# Altium schematic sheet 22-1G_SFP.SchDoc
size B; SheetNumber: 22; SheetTotal: 22
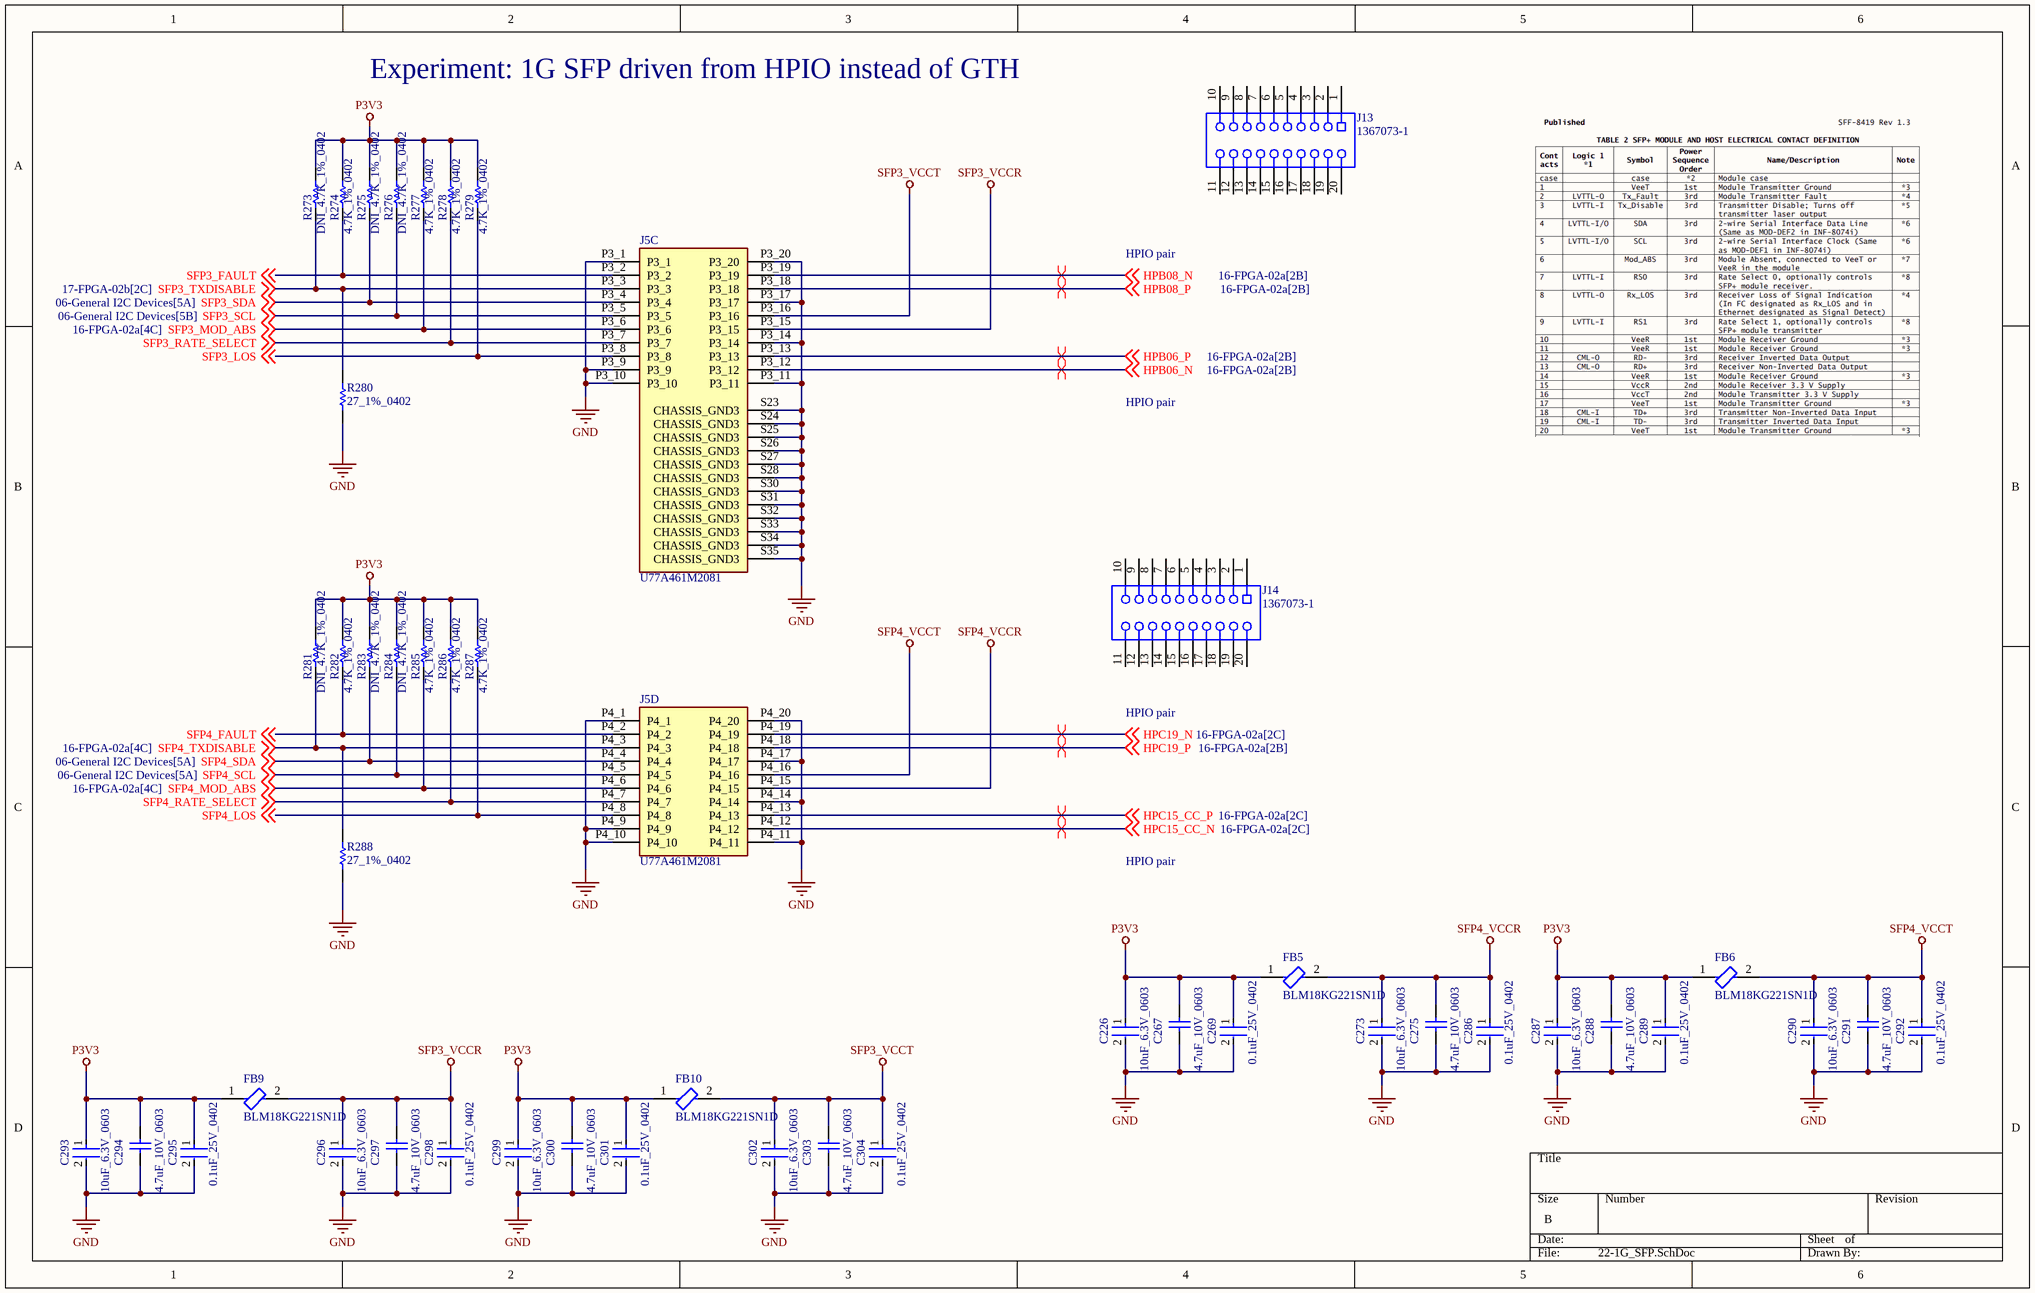
[diagram p0: 22-1G_SFP.SchDoc]

## Parts
C226  10uF_6.3V_0603  [FP-C0603C106M9PACTU-MFG]
C267  4.7uF_10V_0603  [CAPC1608X87X35NL15T15]
C269  0.1uF_25V_0402  [FP-0402-L_1_0_1-W_0_5_0_1-IPC_C]
C273  10uF_6.3V_0603  [FP-C0603C106M9PACTU-MFG]
C275  4.7uF_10V_0603  [CAPC1608X87X35NL15T15]
C286  0.1uF_25V_0402  [FP-0402-L_1_0_1-W_0_5_0_1-IPC_C]
C287  10uF_6.3V_0603  [FP-C0603C106M9PACTU-MFG]
C288  4.7uF_10V_0603  [CAPC1608X87X35NL15T15]
C289  0.1uF_25V_0402  [FP-0402-L_1_0_1-W_0_5_0_1-IPC_C]
C290  10uF_6.3V_0603  [FP-C0603C106M9PACTU-MFG]
C291  4.7uF_10V_0603  [CAPC1608X87X35NL15T15]
C292  0.1uF_25V_0402  [FP-0402-L_1_0_1-W_0_5_0_1-IPC_C]
C293  10uF_6.3V_0603  [FP-C0603C106M9PACTU-MFG]
C294  4.7uF_10V_0603  [CAPC1608X87X35NL15T15]
C295  0.1uF_25V_0402  [FP-0402-L_1_0_1-W_0_5_0_1-IPC_C]
C296  10uF_6.3V_0603  [FP-C0603C106M9PACTU-MFG]
C297  4.7uF_10V_0603  [CAPC1608X87X35NL15T15]
C298  0.1uF_25V_0402  [FP-0402-L_1_0_1-W_0_5_0_1-IPC_C]
C299  10uF_6.3V_0603  [FP-C0603C106M9PACTU-MFG]
C300  4.7uF_10V_0603  [CAPC1608X87X35NL15T15]
C301  0.1uF_25V_0402  [FP-0402-L_1_0_1-W_0_5_0_1-IPC_C]
C302  10uF_6.3V_0603  [FP-C0603C106M9PACTU-MFG]
C303  4.7uF_10V_0603  [CAPC1608X87X35NL15T15]
C304  0.1uF_25V_0402  [FP-0402-L_1_0_1-W_0_5_0_1-IPC_C]
FB5  BLM18KG221SN1D  [FP-BLM18-0_15-t0_8-IPC_B]
FB6  BLM18KG221SN1D  [FP-BLM18-0_15-t0_8-IPC_B]
FB9  BLM18KG221SN1D  [FP-BLM18-0_15-t0_8-IPC_B]
FB10  BLM18KG221SN1D  [FP-BLM18-0_15-t0_8-IPC_B]
J5  U77A461M2081  [AMPHENOL_U77A461M2081]  (parts C,D of 4)
J13  1367073-1  [TECO-1367073-1_V]
J14  1367073-1  [TECO-1367073-1_V]
R273  DNI_4.7K_1%_0402  [RESC1005X40X25NL10T10]  (no BOM)
R274  4.7K_1%_0402  [RESC1005X40X25NL10T10]
R275  DNI_4.7K_1%_0402  [RESC1005X40X25NL10T10]  (no BOM)
R276  DNI_4.7K_1%_0402  [RESC1005X40X25NL10T10]  (no BOM)
R277  4.7K_1%_0402  [RESC1005X40X25NL10T10]
R278  4.7K_1%_0402  [RESC1005X40X25NL10T10]
R279  4.7K_1%_0402  [RESC1005X40X25NL10T10]
R280  27_1%_0402  [RESC1005X40X25NL05T05]
R281  DNI_4.7K_1%_0402  [RESC1005X40X25NL10T10]  (no BOM)
R282  4.7K_1%_0402  [RESC1005X40X25NL10T10]
R283  DNI_4.7K_1%_0402  [RESC1005X40X25NL10T10]  (no BOM)
R284  DNI_4.7K_1%_0402  [RESC1005X40X25NL10T10]  (no BOM)
R285  4.7K_1%_0402  [RESC1005X40X25NL10T10]
R286  4.7K_1%_0402  [RESC1005X40X25NL10T10]
R287  4.7K_1%_0402  [RESC1005X40X25NL10T10]
R288  27_1%_0402  [RESC1005X40X25NL05T05]

## Nets
GND: C226.2 C267.1 C269.2 C273.2 C275.1 C286.2 C287.2 C288.1 C289.2 C290.2 C291.1 C292.2 C293.2 C294.1 C295.2 C296.2 C297.1 C298.2 C299.2 C300.1 C301.2 C302.2 C303.1 C304.2 J5.P3_1 J5.P3_9 J5.P3_10 J5.P3_11 J5.P3_14 J5.P3_17 J5.P3_20 J5.P4_1 J5.P4_9 J5.P4_10 J5.P4_11 J5.P4_14 J5.P4_17 J5.P4_20 J5.S23(CHASSIS_GND3) J5.S24(CHASSIS_GND3) J5.S25(CHASSIS_GND3) J5.S26(CHASSIS_GND3) J5.S27(CHASSIS_GND3) J5.S28(CHASSIS_GND3) J5.S30(CHASSIS_GND3) J5.S31(CHASSIS_GND3) J5.S32(CHASSIS_GND3) J5.S33(CHASSIS_GND3) J5.S34(CHASSIS_GND3) J5.S35(CHASSIS_GND3) R280.1 R288.1
P3V3: C226.1 C267.2 C269.1 C287.1 C288.2 C289.1 C293.1 C294.2 C295.1 C299.1 C300.2 C301.1 FB5.1 FB6.1 FB9.1 FB10.1 R273.1 R274.1 R275.1 R276.1 R277.1 R278.1 R279.1 R281.1 R282.1 R283.1 R284.1 R285.1 R286.1 R287.1
SFP3_VCCR: C296.1 C297.2 C298.1 FB9.2 J5.P3_15
SFP3_VCCT: C302.1 C303.2 C304.1 FB10.2 J5.P3_16
SFP4_VCCR: C273.1 C275.2 C286.1 FB5.2 J5.P4_15
SFP4_VCCT: C290.1 C291.2 C292.1 FB6.2 J5.P4_16
HPB06_N: J5.P3_12 ; off-sheet HPB06_N
HPB06_P: J5.P3_13 ; off-sheet HPB06_P
HPB08_N: J5.P3_19 ; off-sheet HPB08_N
HPB08_P: J5.P3_18 ; off-sheet HPB08_P
HPC15_CC_N: J5.P4_12 ; off-sheet HPC15_CC_N
HPC15_CC_P: J5.P4_13 ; off-sheet HPC15_CC_P
HPC19_N: J5.P4_19 ; off-sheet HPC19_N
HPC19_P: J5.P4_18 ; off-sheet HPC19_P
SFP3_FAULT: J5.P3_2 R274.2 ; off-sheet SFP3_FAULT
SFP3_LOS: J5.P3_8 R279.2 ; off-sheet SFP3_LOS
SFP3_MOD_ABS: J5.P3_6 R277.2 ; off-sheet SFP3_MOD_ABS
SFP3_RATE_SELECT: J5.P3_7 R278.2 ; off-sheet SFP3_RATE_SELECT
SFP3_SCL: J5.P3_5 R276.2 ; off-sheet SFP3_SCL
SFP3_SDA: J5.P3_4 R275.2 ; off-sheet SFP3_SDA
SFP3_TXDISABLE: J5.P3_3 R273.2 R280.2 ; off-sheet SFP3_TXDISABLE
SFP4_FAULT: J5.P4_2 R282.2 ; off-sheet SFP4_FAULT
SFP4_LOS: J5.P4_8 R287.2 ; off-sheet SFP4_LOS
SFP4_MOD_ABS: J5.P4_6 R285.2 ; off-sheet SFP4_MOD_ABS
SFP4_RATE_SELECT: J5.P4_7 R286.2 ; off-sheet SFP4_RATE_SELECT
SFP4_SCL: J5.P4_5 R284.2 ; off-sheet SFP4_SCL
SFP4_SDA: J5.P4_4 R283.2 ; off-sheet SFP4_SDA
SFP4_TXDISABLE: J5.P4_3 R281.2 R288.2 ; off-sheet SFP4_TXDISABLE

Not connected (* = marked no-connect by the designer): J13 1 2 3 4 5 6 7 8 9 10 11 12 13 14 15 16 17 18 19 20; J14 1 2 3 4 5 6 7 8 9 10 11 12 13 14 15 16 17 18 19 20

## Layout directives
differential pair: HPB06_N, HPB06_P, HPB08_N, HPB08_P, HPC15_CC_N, HPC15_CC_P, HPC19_N, HPC19_P

## Notes on the sheet
- Experiment: 1G SFP driven from HPIO instead of GTH
- HPIO pair

## Library data of the parts
C226 C273 C287 C290 C293 C296 C299 C302 = CMP-2006-02285-3: CAP CER 10UF 6.3V X5R 0603; Manufacturer Part Number: C0603C106M9PACTU; Manufacturer: Kemet; Material: Ceramic; Temperature Coefficient: 15%; Tolerance: 20%; Category: Cap; Height: 0.9mm; Digikey Description: CAP CER 10UF 6.3V X5R 0603; Mouser Description: In a Pack of 10, KEMET 0603 (1608M) 10µF MLCC 6.3V dc ±20% SMD C0603C106M9PACTU; Voltage Rating: 6.3V; Device Class L2: Capacitors; Temperature Range Low: -55°C; Temperature Characteristic: X5R; ComponentLink2Description: Datasheet; Ipc Land Pattern Name: CAPC16080X80; ComponentLink2URL: http://www.kemet.com/Lists/ProductCatalog/Attachments/19/KEM_C1006_X5R_SMD.pdf; Capacitance: 10uF; Temperature Range High: +85°C; Device Class L3: Ceramic Capacitors; RoHS: TRUE; Automotive: No; Value: 10uF; Temperature: -55°C to +85°C; Device Class L1: Passive Components; Package: C0603C106M9PACTU; Lead Free: Yes; Octopart: https://octopart.com/c0603c106m9pactu-kemet-8375727
C267 C275 C288 C291 C294 C297 C300 C303 = CMP-2006-03238-1: Part Number: C0603C475K8PACTU; Manufacturer: Kemet
C269 C286 C289 C292 C295 C298 C301 C304 = CMP-2008-02519-2: General Purpose Ceramic Capacitor, 0402, 100nF, 10%, X7R, 15%, 25V; Package Quantity: 1; Capacitance: 100nF; Min Operating Temperature: -55°C; Voltage: 25V; Voltage Rating: 25V; Construction: Flat; Max Operating Temperature: 125°C; Radiation Hardening: No; Depth: 0.5mm; Thickness: 0.022inch; Voltage Rating (DC): 25V; Number of Pins: 2; Lead Free: Lead Free; Series: -; REACH SVHC: No SVHC; Length: 1mm; Dielectric: X7R; RoHS Compliant: Yes; Mount: Surface Mount; Packaging: Tape and Reel; Case/Package: 0402; Case Code (Imperial): 0402; Termination: SMD/SMT; Width: 0.02inch; Case Code (Metric): 1005; Tolerance: 10%
FB5 FB6 FB9 FB10 = CMP-0686-00556-7: Chip Ferrite Bead, 0603, 220Ω @ 100MHz, 0.05Ω, 25%, 2.2A; DC Resistance (DCR): 50mR; Number of Circuits: 1; Impedance: 220R; Current Rating: 2.2A; Material: Ferrite; Test Frequency: 100MHz; Depth: 0.8mm; Series: BLM18K; RoHS Compliant: Yes; Termination: SMD/SMT; Max Current Rating: 2.2A; Case Code (Metric): 1608; Radiation Hardening: No; Number of Pins: 2; Length: 1.6mm; Lead Free: Lead Free; Package Quantity: 1; Height: 0.8mm; Core Material: Ferrite; Inductor Type: FERRITE BEAD; Min Operating Temperature: -55°C; Case/Package: 0603; Case Code (Imperial): 0603; Number of Lines: 1; Packaging: Tape and Reel; REACH SVHC: No SVHC; Max Operating Temperature: 125°C; Military Standard: Not; DC Resistance-Max: 50mR; Width: 0.8mm; DC Current: 2.2A; Max DC Current: 2.2A; Tolerance: 25%; Weight: 7.1E-05oz
J5 = U77A461M2081: MF: AMPHENOL ICC / FCI; Package: None; Price: None; Value: *; MP: U77A461M2081; Availability: Unavailable
J13 J14 = CMP-2000-05488-1: Female Connector, Pitch 0.8 mm, 2 x 10 Position, Height 5.4 mm, -55 to 85 degC, RoHS, Tape and Reel; Manufacturer: TE Connectivity; Product Training Modules: HighSpeedPluggableI/OSolutions; 3D Model: 1367073-1.pdf; Connector Type: SFP; Other Names: A97430DKR; Mating Products: 516-2084-ND / -TXRXOPTICALSFF1.25GBDISCSI; Dynamic Catalog: SFPConnectors; Featured Product: HighSpeedPluggableI-OSolutions; Connector Style: Receptacle; Associated Product: A103997CT-ND / -CONNSFPCAGESINGLEW/OPIPE / A103997TR-ND / -CONNSFPCAGESINGLEW/OPIPE / 1367645-3-ND / -CONNCAGE&HEATSINKSGLPORTTIN / 1367645-2-ND / -CONNCAGE&HEATSINKSGLPORTTIN / 1888424-1-ND / -CONNCAGE1X2SFPENHANCEDEMI / 1367643-1-ND / -CONNCAGESNGLPORTDBLSIDETIN / 1489962-1-ND / -CONNSFPCAGESINGLEW/OPIPE / 1367645-1-ND / -CONNCAGE&HEATSINKSGLPORTTIN / A99375-ND / -CONNSFPCAGE1X4PIN-IN-PASTE / A97412CT-ND / -CONNSFPLOWERCAGEPCB / More...; Number of Positions: 20; Package Reference: 1367073-1; Package Description: Female Connector, Pitch 0.8 mm, 2 x 10 Position, Height 5.4 mm; RoHS Information: 1367073-1StatementofCompliance; Contact Finish: Gold; Datasheet URL: http://www.te.com/commerce/DocumentDelivery/DDEController?Action=showdoc&DocId=Customer+Drawing%7F1367073%7FK%7Fpdf%7FEnglish%7FENG_CD_1367073_K.pdf%7F1367073-1; Datasheet Version: Rev. K, 12/2012; Contact Finish Thickness: 15µin(0.38µm); Category: Connectors,Interconnects; Mounting Type: SurfaceMount,RightAngle; Mounting Technology: SurfaceMount; Packaging: Digi-Reel®; Manufacturer URL: http://www.te.com/; Family: PluggableConnectors; Standard Package: 1; Termination: Solder
R273-R279 R281-R287 = CMP-2002-05217-1: Manufacturer: Bourns; Part Number: CR0402-FX-4701GLF
R280 R288 = CMP-2002-08434-1: Part Number: CRCW040227R0FKED; Manufacturer: Vishay Dale